# Altium schematic sheet Motor Driver Unit.SchDoc: Motor Driver Unit
size A3; DrawnBy: Adrien Dos SANTOS; Organization: Altium Limited; Revision: REV 1.0; SheetNumber: 3; SheetTotal: 5; ProjectName: projname
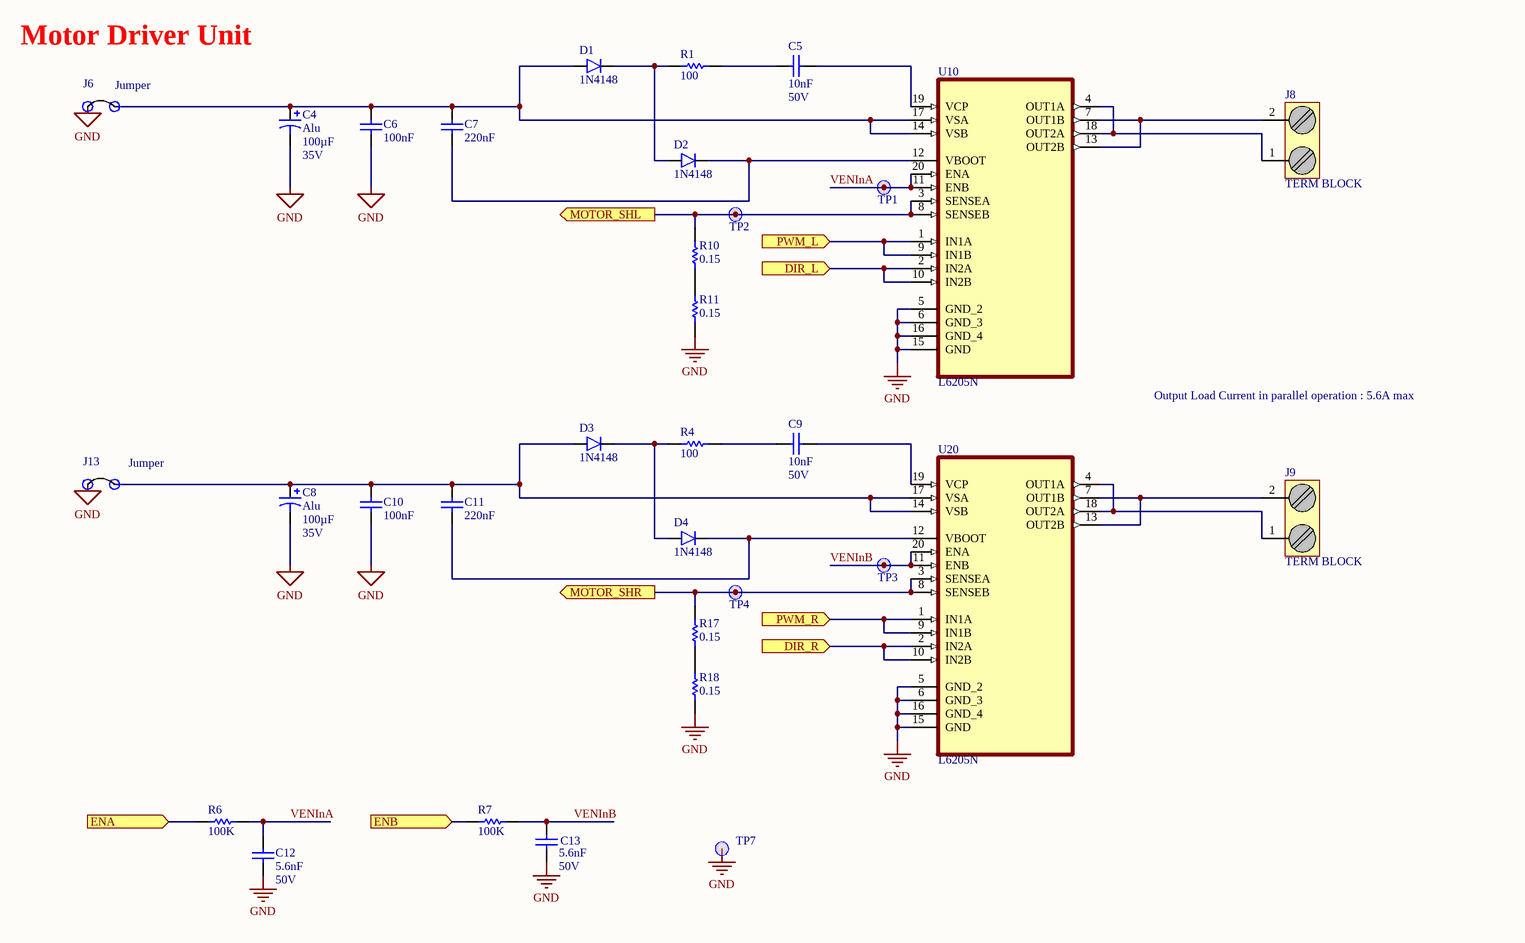
[diagram p0: Motor Driver Unit.SchDoc]

## Parts
C4  Alu  Capacitance: 100µF  Voltage: 35V  [UWT1V101MCL1GS]
C5  value 10nF  Voltage - Rated: 50V  [CC0603 x 0.90mm]  (hidden comment: CAP)
C6  value 100nF  [CC0805 x 0.90mm]  (hidden comment: CAP)
C7  value 220nF  [CC0805 x 0.90mm]  (hidden comment: CAP)
C8  Alu  Capacitance: 100µF  Voltage: 35V  [UWT1V101MCL1GS]
C9  value 10nF  Voltage - Rated: 50V  [CC0603 x 0.90mm]  (hidden comment: CAP)
C10  value 100nF  [CC0805 x 0.90mm]  (hidden comment: CAP)
C11  value 220nF  [CC0603 x 0.9mm]  (hidden comment: CAP)
C12  value 5.6nF  Voltage - Rated: 50V  [CC0603 x 0.90mm]  (hidden comment: CAP)
C13  value 5.6nF  Voltage - Rated: 50V  [CC0603 x 0.90mm]  (hidden comment: CAP)
D1  1N4148  [SOD323]
D2  1N4148  [SOD323]
D3  1N4148  [SOD323]
D4  1N4148  [SOD323]
J6  Jumper  [68002-102HLF]
J8  TERM BLOCK  [282841-2]
J9  TERM BLOCK  [282841-2]
J13  Jumper  [68002-102HLF]
R1  value 100  [RESC0603_N]  (hidden comment: RES)
R4  value 100  [RESC0603_N]  (hidden comment: RES)
R6  value 100K  [RESC0603_N]  (hidden comment: RES)
R7  value 100K  [RESC0603_N]  (hidden comment: RES)
R10  value 0.15  [RESC0603_N]  (hidden comment: RES)
R11  value 0.15  [RESC0603_N]  (hidden comment: RES)
R17  value 0.15  [RESC0603_N]  (hidden comment: RES)
R18  value 0.15  [RESC0603_N]  (hidden comment: RES)
TP1  TEST_POINT_1.27mm  [Test_Point1.27mm]  (value not drawn)  (no BOM)
TP2  TEST_POINT_1.27mm  [Test_Point1.27mm]  (value not drawn)  (no BOM)
TP3  TEST_POINT_1.27mm  [Test_Point1.27mm]  (value not drawn)  (no BOM)
TP4  TEST_POINT_1.27mm  [Test_Point1.27mm]  (value not drawn)  (no BOM)
TP7  TEST_POINT_1.27mm  [Test_Point1.27mm]  (value not drawn)  (no BOM)
U10  L6205N  [DIP254P762X510-20]
U20  L6205N  [DIP254P762X510-20]

## Ports
DIR_L (in), DIR_R (in), ENA (in), ENB (in), MOTOR_SHL (out), MOTOR_SHR (out), PWM_L (in), PWM_R (in)

## Nets
GND: C4.2 C6.1 C8.2 C10.1 C12.1 C13.1 J6.1 J13.1 R11.1 R18.1 TP7.1 U10.5(GND_2) U10.6(GND_3) U10.15(GND) U10.16(GND_4) U20.5(GND_2) U20.6(GND_3) U20.15(GND) U20.16(GND_4)
DIR_L: U10.2(IN2A) U10.10(IN2B) ; port DIR_L
DIR_R: U20.2(IN2A) U20.10(IN2B) ; port DIR_R
ENA: R6.2 ; port ENA
ENB: R7.2 ; port ENB
MOTOR_SHL: R10.2 TP2.1 U10.3(SENSEA) U10.8(SENSEB) ; port MOTOR_SHL
MOTOR_SHR: R17.2 TP4.1 U20.3(SENSEA) U20.8(SENSEB) ; port MOTOR_SHR
PWM_L: U10.1(IN1A) U10.9(IN1B) ; port PWM_L
PWM_R: U20.1(IN1A) U20.9(IN1B) ; port PWM_R
VENInA: C12.2 R6.1 TP1.1 U10.11(ENB) U10.20(ENA)
VENInB: C13.2 R7.1 TP3.1 U20.11(ENB) U20.20(ENA)
NetC4_1: C4.1 C6.2 C7.2 D1.1(A) J6.2 U10.14(VSB) U10.17(VSA)
NetC5_1: C5.1 R1.2
NetC5_2: C5.2 U10.19(VCP)
NetC7_1: C7.1 D2.2(K) U10.12(VBOOT)
NetC8_1: C8.1 C10.2 C11.2 D3.1(A) J13.2 U20.14(VSB) U20.17(VSA)
NetC9_1: C9.1 R4.2
NetC9_2: C9.2 U20.19(VCP)
NetC11_1: C11.1 D4.2(K) U20.12(VBOOT)
NetD1_2: D1.2(K) D2.1(A) R1.1
NetD3_2: D3.2(K) D4.1(A) R4.1
NetJ8_1: J8.1 U10.4(OUT1A) U10.18(OUT2A)
NetJ8_2: J8.2 U10.7(OUT1B) U10.13(OUT2B)
NetJ9_1: J9.1 U20.4(OUT1A) U20.18(OUT2A)
NetJ9_2: J9.2 U20.7(OUT1B) U20.13(OUT2B)
NetR10_1: R10.1 R11.2
NetR17_1: R17.1 R18.2

## Notes on the sheet
- Motor Driver Unit
- Output Load Current in parallel operation : 5.6A max
- Title
- Size:
- Date:
- A3
- Revision:
- Time:
- Sheet
- of
- Avnet EMG France SA
- 12 rue Jean Bart
- 91120 MASSY - FR
- File:
- Drawn by :

## Library data of the parts
C4 C8 = UWT1V101MCL1GS: CAP ALUM 100UF 20% 35V SMD; Manufacturer: Nichicon; Currency: EUR; Part Number: UWT1V101MCL1GS; Price: 0.0452; MOQ: 18000; Avnet Part Number: NCHUWT1V101MCL1GS
C5 C9 = CC0603KRX7R9BB103: 10000pF ±10% 50V Ceramic Capacitor X7R 0603 (1608 Metric); manufacturer: Yageo; Manufacturer Standard Lead Time: 16 Weeks; currency: USD; idx: 519; Package Inch: 0603; Package Metric: 1608; Normalized value µF: 0.01; Part Number: CC0603KRX7R9BB103; price: *; Rated Voltage: *; Tolerance: ±10%; Temperature Coefficient: X7R; MOQ: *; ComponentLink1URL: https://www.yageo.com/upload/media/product/productsearch/datasheet/mlcc/UPY-GPHC_X7R_6.3V-to-50V_18.pdf; ProductLink: https://www.digikey.com/product-detail/en/yageo/CC0603KRX7R9BB103/311-1085-2-ND/302819; Digi-Key Part Number: 311-1085-2-ND; Operating Temperature: -55°C ~ 125°C; Lead Free Status / RoHS Status: Lead free / ROHS3 Compliant; Mounting Type: Surface Mount, MLCC; Size / Dimension: 0.063" L x 0.031" W (1.60mm x 0.80mm); Thickness (Max): 0.035" (0.90mm); Thickness mm: 0.90; Thickness Inch: 0.035; Length Inch: 0.063; Width Inch: 0.031; Length mm: 1.60; Width mm: 0.80; Series: CC; Part Status: Active; Package / Case: 0603 (1608 Metric); Lead Style: -; Packaging: Tape & Reel (TR); Moisture Sensitivity Level (MSL): 1  (Unlimited); Applications: General Purpose; Height - Seated (Max): -; Lead Spacing: -; Capacitance: 10000pF; Features: -; Ratings: -; Failure Rate: -
C6 C10 = C0805X104KMREC: currency: USD; manufacturer: *; Part Number: *; price: *; Rated Voltage: *; Tolerance: *; Temperature Coefficient: *; MOQ: *
C7 = C0805X224JMREC: currency: USD; manufacturer: *; Part Number: *; price: *; Rated Voltage: *; Tolerance: *; Temperature Coefficient: *; MOQ: *
C11 = CS0603KRX7R8BB224: currency: USD; manufacturer: *; Part Number: *; price: *; Rated Voltage: *; Tolerance: *; Temperature Coefficient: *; MOQ: *
C12 C13 = CC0603JRX7R9BB562: 5600pF ±5% 50V Ceramic Capacitor X7R 0603 (1608 Metric); manufacturer: Yageo; Manufacturer Standard Lead Time: 17 Weeks; currency: USD; idx: 31442; Package Inch: 0603; Package Metric: 1608; Normalized value µF: 0.0056; Part Number: CC0603JRX7R9BB562; price: *; Rated Voltage: *; Tolerance: ±5%; Temperature Coefficient: X7R; MOQ: *; ComponentLink1URL: https://www.yageo.com/upload/media/product/productsearch/datasheet/mlcc/UPY-GPHC_X7R_6.3V-to-50V_18.pdf; ProductLink: https://www.digikey.com/product-detail/en/yageo/CC0603JRX7R9BB562/311-4021-2-ND/5883696; Digi-Key Part Number: 311-4021-2-ND; Operating Temperature: -55°C ~ 125°C; Lead Free Status / RoHS Status: Lead free / ROHS3 Compliant; Mounting Type: Surface Mount, MLCC; Size / Dimension: 0.063" L x 0.031" W (1.60mm x 0.80mm); Thickness (Max): 0.035" (0.90mm); Thickness mm: 0.90; Thickness Inch: 0.035; Length Inch: 0.063; Width Inch: 0.031; Length mm: 1.60; Width mm: 0.80; Series: CC; Part Status: Active; Package / Case: 0603 (1608 Metric); Lead Style: -; Packaging: Tape & Reel (TR); Moisture Sensitivity Level (MSL): 1  (Unlimited); Applications: General Purpose; Height - Seated (Max): -; Lead Spacing: -; Capacitance: 5600pF; Features: -; Ratings: -; Failure Rate: -
D1-D4 = 1N4148WS-7-F: 75V 300mA SURFACE MOUNT FAST SWITCHING DIODE; manufacturer: Diodes Inc.; currency: USD; Part Number: 1N4148WS-7-F; price: 0.02; MOQ: 3000
J6 J13 = 68002-102HLF JMP: JUMPER Headers 2POS 2.54mm pitch for jumper; Manufacturer: Amphenol FCI; Number of Contacts: 2; Current Rating: 3A; Voltage Rating: 1.5kV; Insulation Resistance: 5GR; Gender: Male; Connector Type: Male Pin; Contact Post Length: 3.81mm; Supplier 1: Digi-Key; Part Number: 68002-102HLF; RoHS: Yes; Category: Board to Board Connectors; Stock 1: 4863; Pricing 1: 1=0,33000, 10=0,31600, 100=0,22120, 500=0,18964, 1000=0,15803, 5000=0,13545, 10000=0,12642 (USD); Mount: Through Hole; Contact Plating: Gold,GXT; Contact Material: Bronze; Color: Black; Housing Color: Black; Housing Material: Thermoplastic; Min Operating Temperature: -65°C; Max Operating Temperature: 125°C; Number of Rows: 1; Termination: Solder; Packaging: Bulk; Contact Gender: Male; Package Quantity: 100; Number of Positions: 2; Max Voltage Rating (AC): 1.5kV; Orientation: Straight; Length: 5.08mm; Pitch: 2.54mm; Contact Mating Length: 0.23inch; Depth: 2.41mm; Radiation Hardening: No; Lead Free: Lead Free; Flammability Rating: UL94 V-0; ComponentLink1URL: https://datasheet.ciiva.com/16726/68000-16726189.pdf?src-supplier=Avnet+Europe; ComponentLink1Description: https://datasheet.ciiva.com/16726/68000-16726189.pdf?src-supplier=Avnet+Europe; ComponentLink2URL: https://datasheet.ciiva.com/721/68000-721356.pdf?src-supplier=Digi-Key; ComponentLink2Description: https://datasheet.ciiva.com/721/68000-721356.pdf?src-supplier=Digi-Key
J8 J9 = 282841-2: TERM BLOCK 2POS SIDE ENT 5.08MM; Manufacturer: TE Connectivity; currency: USD; Part Number: 282841-2; price: 1.7; MOQ: *
R1 R4 = 9C06031A1000FKHFT: RES 100 OHM 1/10W 1% 0603 SMD; manufacturer: Yageo; currency: USD; Rated Power: 0.1W, 1/10W; smt_res_0603id: 202386; sub_category_id: 619; category_id: 33; Temperature Coefficient: ±100ppm/°C; lead_style: Surface Mount (SMD - SMT); Value Unit: 1; MOQ: 5.000; Part Number: 9C06031A1000FKHFT; price: Call; image: http://media.digikey.com/Photos/NoPhoto/NoPhoto_TMB.jpg; Digikey PN: 311-100HTR-ND; series: RC0603; composition: Thick Film; features: -; Tolerance: ±1%; Case: 0603 (1608 metric); Size Dimension: 0.063" L x 0.031" W (1.60mm x 0.80mm); Height: 0.018" (0.45mm); packaging: Tape & Reel (TR); quantity_available: 0Note; datasheet: http://www.yageo.com/pdf/Pu-RC0603_51_PbFree_L_2.pdf; Normalized Value: 100; Display Value: 100; Value_in_ohm: 100
R6 R7 = RT0603DRE07100KL: RES 100K OHM 1/10W .5% SMD 0603; manufacturer: Yageo; currency: USD; Rated Power: 0.1W, 1/10W; smt_res_0603id: 67727; sub_category_id: 619; category_id: 33; Temperature Coefficient: ±50ppm/°C; Tolerance: ±0.5%; lead_style: Surface Mount (SMD - SMT); Value Unit: 1000; Normalized Value: 100; Value_in_ohm: 100000; MOQ: 15.000; Part Number: RT0603DRE07100KL; price: 0.01200; image: http://media.digikey.com/Renders/Yageo%20Renders/RC0603FR-0710RL_tmb.jpg; Digikey PN: RT0603DRE07100KL-ND; series: RT; composition: Thin Film; features: -; Case: 0603 (1608 metric); Size Dimension: 0.063" L x 0.031" W (1.60mm x 0.80mm); Height: 0.018" (0.45mm); packaging: Tape & Reel (TR); quantity_available: 5,000; datasheet: http://www.yageo.com/pdf/PYu-RT_1-to-0.05_RoHS_L_3.pdf; Display Value: 100K
R10 R11 R17 R18 = RL0603FR-070R15L: RES .15 OHM 1/10W 1% 0603 SMD; manufacturer: Yageo; currency: USD; Rated Power: 0.1W, 1/10W; smt_res_0603id: 43191; sub_category_id: 619; category_id: 33; Temperature Coefficient: ±800ppm/°C; lead_style: Surface Mount (SMD - SMT); Value Unit: 1; Display Value: 150m; MOQ: 5.000; Part Number: RL0603FR-070R15L; price: 0.12700; image: http://media.digikey.com/Renders/Yageo%20Renders/RC0603FR-0710RL_tmb.jpg; Digikey PN: 311-.15QTR-ND; series: RL; composition: Thick Film; features: -; Tolerance: ±1%; Case: 0603 (1608 metric); Size Dimension: 0.063" L x 0.031" W (1.60mm x 0.80mm); Height: 0.018" (0.45mm); packaging: Tape & Reel (TR); quantity_available: 15,000Note / Alternate Packaging; datasheet: http://www.yageo.com/pdf/Pu-RL_51_PbFree_L_1.pdf; Normalized Value: 0.15; Value_in_ohm: 0.15
U10 U20 = L6205N: L6205N DIP Half H-Bridge Driver _Internal FET_ Power Management Evaluation Board; MF: STMicroelectronics; Price: None; SnapEDA_Link: https://www.snapeda.com/parts/L6205N/STMicroelectronics/view-part/41353/?ref=snap; MP: L6205N; Availability: Unavailable; Value: *; Package: DIP-20 STMicroelectronics